# EAGLE schematic module_template_core (EAGLE 5.10)
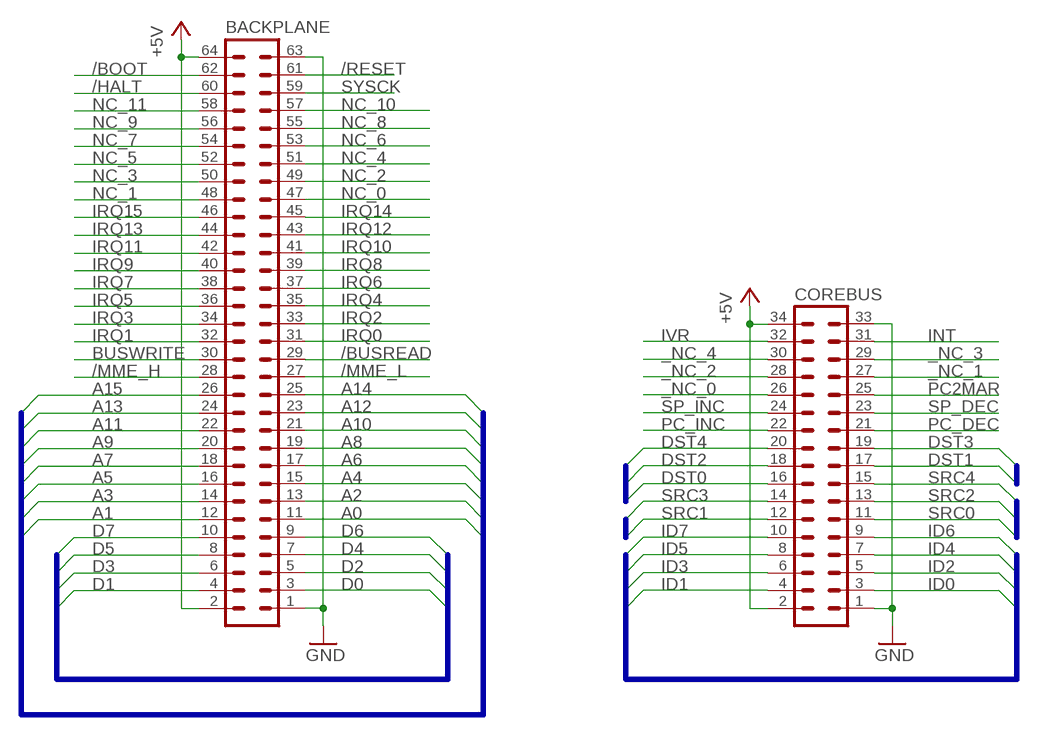
[diagram p0: schematic, sheet 1]

## Parts
BACKPLANE  ML64L  [ML64L]
COREBUS  ML34L  [ML34L]

## Nets
+5V: BACKPLANE.2 BACKPLANE.64 COREBUS.2 COREBUS.34
/BOOT: BACKPLANE.62
/BUSREAD: BACKPLANE.29
/HALT: BACKPLANE.60
/MME_H: BACKPLANE.28
/MME_L: BACKPLANE.27
/RESET: BACKPLANE.61
_NC_0: COREBUS.26
_NC_1: COREBUS.27
_NC_2: COREBUS.28
_NC_3: COREBUS.29
_NC_4: COREBUS.30
A0: BACKPLANE.11
A1: BACKPLANE.12
A2: BACKPLANE.13
A3: BACKPLANE.14
A4: BACKPLANE.15
A5: BACKPLANE.16
A6: BACKPLANE.17
A7: BACKPLANE.18
A8: BACKPLANE.19
A9: BACKPLANE.20
A10: BACKPLANE.21
A11: BACKPLANE.22
A12: BACKPLANE.23
A13: BACKPLANE.24
A14: BACKPLANE.25
A15: BACKPLANE.26
BUSWRITE: BACKPLANE.30
D0: BACKPLANE.3
D1: BACKPLANE.4
D2: BACKPLANE.5
D3: BACKPLANE.6
D4: BACKPLANE.7
D5: BACKPLANE.8
D6: BACKPLANE.9
D7: BACKPLANE.10
DST0: COREBUS.16
DST1: COREBUS.17
DST2: COREBUS.18
DST3: COREBUS.19
DST4: COREBUS.20
GND: BACKPLANE.1 BACKPLANE.63 COREBUS.1 COREBUS.33
ID0: COREBUS.3
ID1: COREBUS.4
ID2: COREBUS.5
ID3: COREBUS.6
ID4: COREBUS.7
ID5: COREBUS.8
ID6: COREBUS.9
ID7: COREBUS.10
INT: COREBUS.31
IRQ0: BACKPLANE.31
IRQ1: BACKPLANE.32
IRQ2: BACKPLANE.33
IRQ3: BACKPLANE.34
IRQ4: BACKPLANE.35
IRQ5: BACKPLANE.36
IRQ6: BACKPLANE.37
IRQ7: BACKPLANE.38
IRQ8: BACKPLANE.39
IRQ9: BACKPLANE.40
IRQ10: BACKPLANE.41
IRQ11: BACKPLANE.42
IRQ12: BACKPLANE.43
IRQ13: BACKPLANE.44
IRQ14: BACKPLANE.45
IRQ15: BACKPLANE.46
IVR: COREBUS.32
NC_0: BACKPLANE.47
NC_1: BACKPLANE.48
NC_2: BACKPLANE.49
NC_3: BACKPLANE.50
NC_4: BACKPLANE.51
NC_5: BACKPLANE.52
NC_6: BACKPLANE.53
NC_7: BACKPLANE.54
NC_8: BACKPLANE.55
NC_9: BACKPLANE.56
NC_10: BACKPLANE.57
NC_11: BACKPLANE.58
PC2MAR: COREBUS.25
PC_DEC: COREBUS.21
PC_INC: COREBUS.22
SP_DEC: COREBUS.23
SP_INC: COREBUS.24
SRC0: COREBUS.11
SRC1: COREBUS.12
SRC2: COREBUS.13
SRC3: COREBUS.14
SRC4: COREBUS.15
SYSCK: BACKPLANE.59

## Buses
D[0..7]
A[0..15]
ID[0..7]
DST[0..4]
SRC[0..4]

## Library data of the parts
BACKPLANE = mcpu:ML64L: HARTING
COREBUS = mcpu:ML34L: HARTING

## Net classes
0 Signal: width 0.305 mm, drill 0.508 mm, clearance 0.203 mm
1 LoVolt42: width 0.61 mm, drill 0.508 mm, clearance 0.813 mm to class 0, clearance 0.305 mm
2 MedVolt100: width 0.61 mm, drill 0.508 mm, clearance 1.626 mm to class 0, clearance 1.626 mm to class 1, clearance 0.813 mm
3 LineVolt350: width 0.813 mm, drill 0.508 mm, clearance 12.7 mm to class 0, clearance 12.7 mm to class 1, clearance 12.7 mm to class 2, clearance 2.54 mm